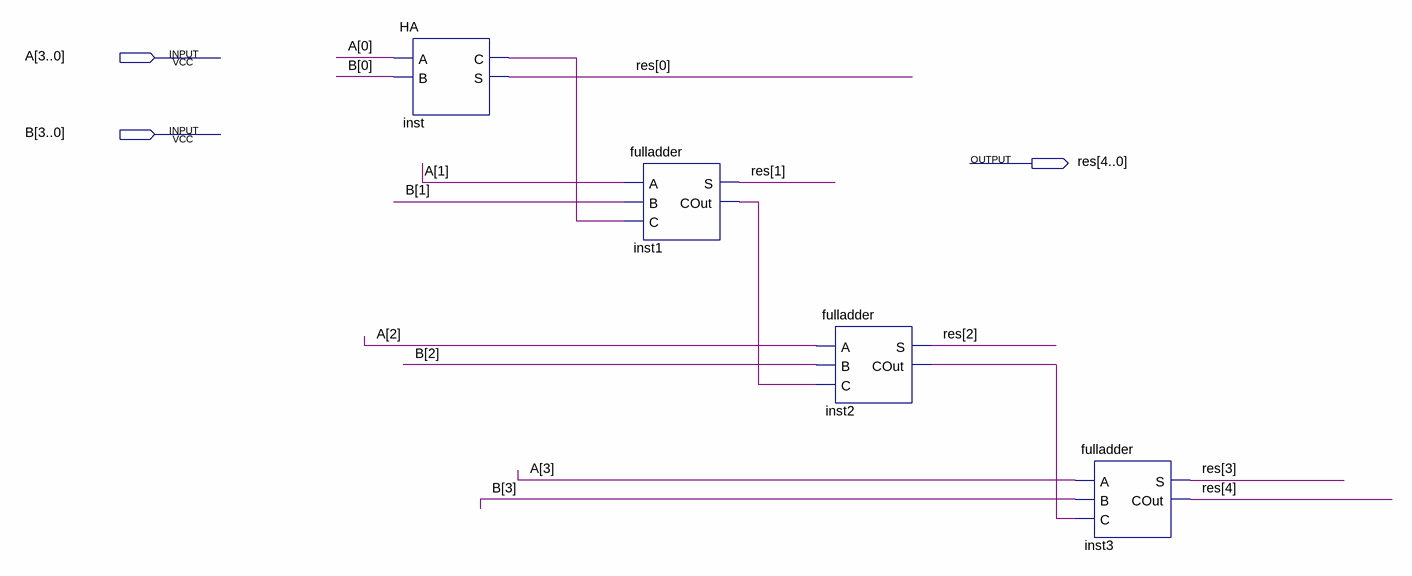
[diagram p0: schematic sheet]
// Quartus schematic 4bitFA.bdf as structural Verilog: 4 symbols, 3 pins
module \4bitFA  (
  input  [3:0] A,
  input  [3:0] B,
  output [4:0] res
);

  wire inst1_cout, inst2_cout, inst_c;

  HA inst (.A(A[0]), .B(B[0]), .C(inst_c), .S(res[0]));
  fulladder inst1 (.A(A[1]), .B(B[1]), .C(inst_c), .S(res[1]), .COut(inst1_cout));
  fulladder inst2 (.A(A[2]), .B(B[2]), .C(inst1_cout), .S(res[2]), .COut(inst2_cout));
  fulladder inst3 (.A(A[3]), .B(B[3]), .C(inst2_cout), .S(res[3]), .COut(res[4]));
endmodule
